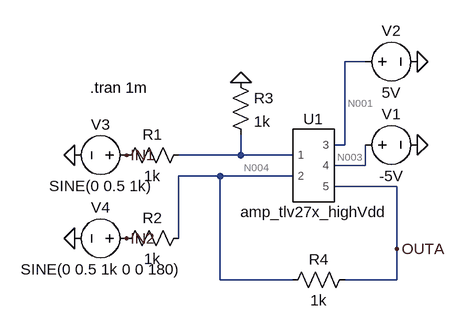
[diagram p0: schematic Pre-Lab-6-a.asc]
Pre-Lab-6-a.asc, the LTspice schematic file:
Version 4.1
SHEET 1 1704 876
WIRE 688 176 656 176
WIRE 656 304 656 176
WIRE 656 304 640 304
WIRE 496 320 496 288
WIRE 496 320 400 320
WIRE 576 320 496 320
WIRE 688 336 688 304
WIRE 688 336 640 336
WIRE 464 352 400 352
WIRE 576 352 464 352
WIRE 736 368 640 368
WIRE 400 448 400 352
WIRE 736 464 736 368
WIRE 464 512 464 352
WIRE 576 512 464 512
WIRE 736 512 736 464
WIRE 736 512 656 512
FLAG 768 176 0
FLAG 768 304 0
FLAG 240 320 0
FLAG 240 448 0
FLAG 736 464 OUTA
FLAG 320 448 IN2
FLAG 320 320 IN1
FLAG 496 208 0
SYMBOL amp_tlv27x_highVdd1 608 336 R0
SYMATTR InstName U1
SYMBOL res 416 304 R90
WINDOW 0 0 56 VBottom 2
WINDOW 3 32 56 VTop 2
SYMATTR InstName R1
SYMATTR Value 1k
SYMBOL res 416 432 R90
WINDOW 0 0 56 VBottom 2
WINDOW 3 32 56 VTop 2
SYMATTR InstName R2
SYMATTR Value 1k
SYMBOL res 480 192 R0
SYMATTR InstName R3
SYMATTR Value 1k
SYMBOL res 672 496 R90
WINDOW 0 0 56 VBottom 2
WINDOW 3 32 56 VTop 2
SYMATTR InstName R4
SYMATTR Value 1k
SYMBOL voltage 672 304 R270
WINDOW 0 32 56 VTop 2
WINDOW 3 -32 56 VBottom 2
WINDOW 123 0 0 Left 0
WINDOW 39 0 0 Left 0
SYMATTR InstName V1
SYMATTR Value -5V
SYMBOL voltage 672 176 R270
WINDOW 0 32 56 VTop 2
WINDOW 3 -32 56 VBottom 2
WINDOW 123 0 0 Left 0
WINDOW 39 0 0 Left 0
SYMATTR InstName V2
SYMATTR Value 5V
SYMBOL voltage 336 320 R90
WINDOW 0 -32 56 VBottom 2
WINDOW 3 32 56 VTop 2
WINDOW 123 0 0 Left 0
WINDOW 39 0 0 Left 0
SYMATTR InstName V3
SYMATTR Value SINE(0 0.5 1k)
SYMBOL voltage 336 448 R90
WINDOW 0 -32 56 VBottom 2
WINDOW 3 32 56 VTop 2
WINDOW 123 0 0 Left 0
WINDOW 39 0 0 Left 0
SYMATTR InstName V4
SYMATTR Value SINE(0 0.5 1k 0 0 180)
TEXT 264 216 Left 2 !.tran 1m

The netlist it stands for:
* Pre-Lab-6-a.asc
X§U1 N002 N004 N001 N003 OUTA amp_tlv27x_highVdd  ; pins 1 2 3 4 5
R1 N002 IN1 1k
R2 N004 IN2 1k
R3 0 N002 1k
R4 OUTA N004 1k
V1 N003 0 -5V
V2 N001 0 5V
V3 IN1 0 SINE(0 0.5 1k)
V4 IN2 0 SINE(0 0.5 1k 0 0 180)
.tran 1m
.lib TLV271.LIB
.backanno
.end

* Results of the author's LTspice run, read from the files saved beside the schematic
* Operating Point, zero values left out:
*   V(n001) = 5 V
*   V(n003) = -5 V
*   V(n004) = -280.4 µV
*   V(outa) = -560.8 µV
*   I(R1) = 3.45 pA
*   I(R2) = -280.4 nA
*   I(R3) = -3.45 pA
*   I(R4) = -280.4 nA
*   I(V1) = 67.78 µA
*   I(V2) = -67.78 µA
*   I(V3) = 3.45 pA
*   I(V4) = -280.4 nA
*   Ix(u1:1) = -6.9 pA
*   Ix(u1:2) = -6.901 pA
*   Ix(u1:3) = 67.78 µA
*   Ix(u1:4) = -67.78 µA
*   Ix(u1:5) = 280.4 nA
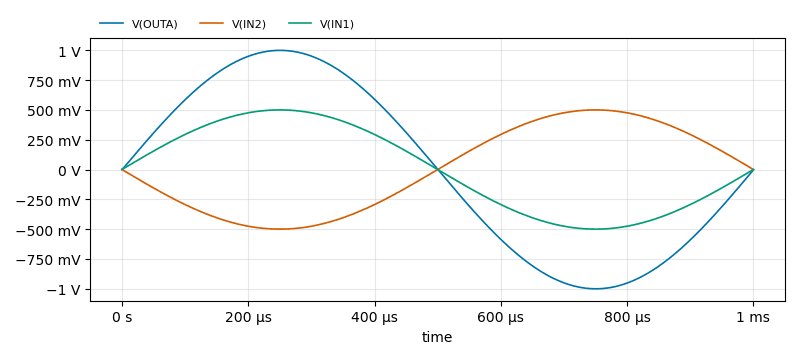
[diagram p1: Transient Analysis of Pre-Lab-6-a.asc, plotted from the saved traces]
* Transient Analysis, 1 run:
*   V(OUTA): min -1 V, max 999.2 mV, average -558.9 µV, rms 707 mV, last -3.302 mV
*   V(IN2): min -500 mV, max 500 mV, average 0 V, rms 353.6 mV, last 0 V
*   V(IN1): min -500 mV, max 500 mV, average 0 V, rms 353.6 mV, last 0 V